# EAGLE design led-test (EAGLE 9.6.2)
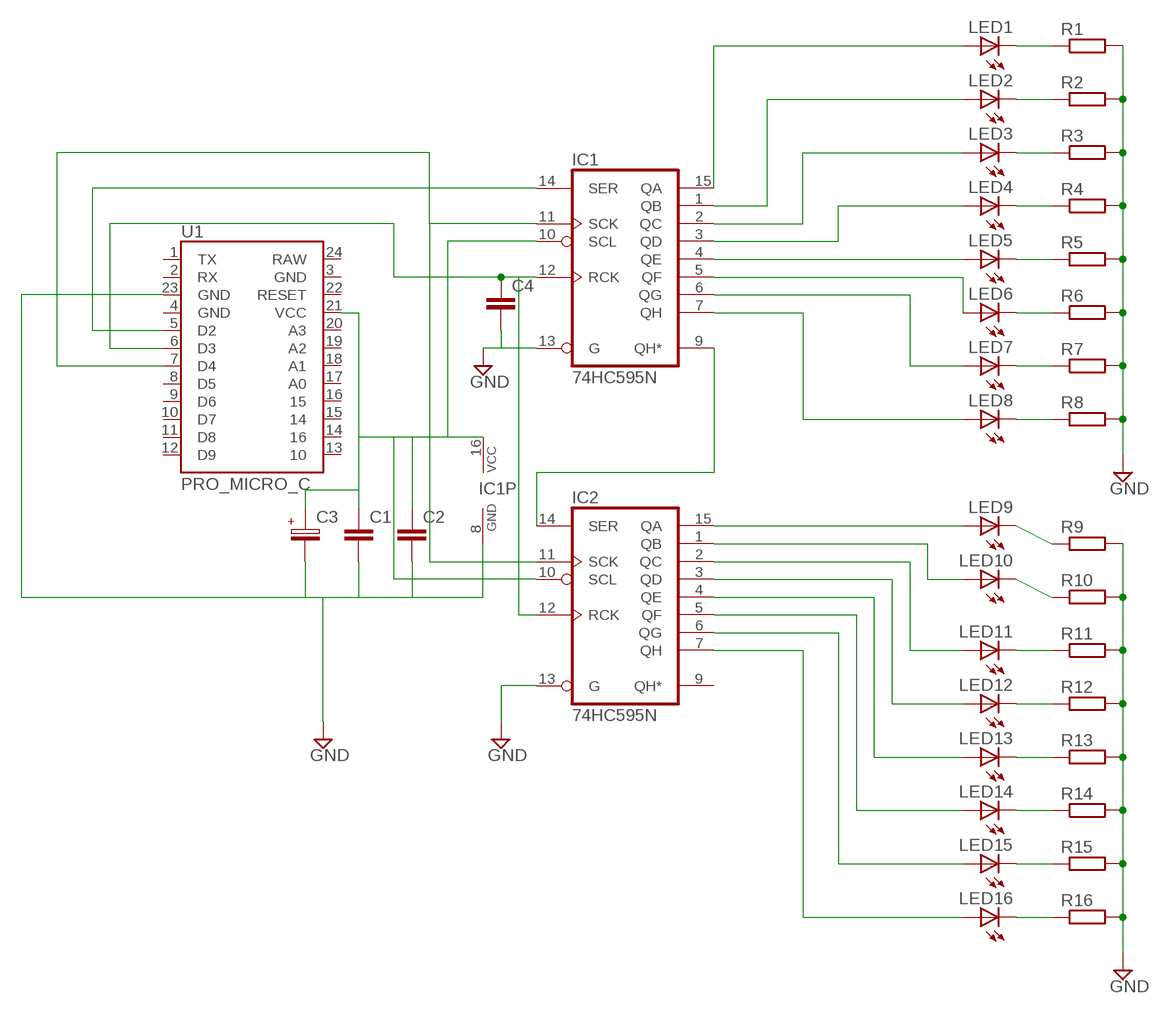
[diagram p0: schematic, sheet 1]

## Parts
C1  072X0252  [072X025]
C2  072X0252  [072X025]
C3  050-EU  [050_020]
C4  072X0252  [072X025]
IC1  74HC595N  [DIL16]
IC2  74HC595N  [DIL16]
LED1  LED  [SMARTLED-TTW]
LED2  LED  [SMARTLED-TTW]
LED3  LED  [SMARTLED-TTW]
LED4  LED  [SMARTLED-TTW]
LED5  LED  [SMARTLED-TTW]
LED6  LED  [SMARTLED-TTW]
LED7  LED  [SMARTLED-TTW]
LED8  LED  [SMARTLED-TTW]
LED9  LED  [SMARTLED-TTW]
LED10  LED  [SMARTLED-TTW]
LED11  LED  [SMARTLED-TTW]
LED12  LED  [SMARTLED-TTW]
LED13  LED  [SMARTLED-TTW]
LED14  LED  [SMARTLED-TTW]
LED15  LED  [SMARTLED-TTW]
LED16  LED  [SMARTLED-TTW]
R1  R-EU_0204/7  [0204/7]
R2  R-EU_0204/7  [0204/7]
R3  R-EU_0204/7  [0204/7]
R4  R-EU_0204/7  [0204/7]
R5  R-EU_0204/7  [0204/7]
R6  R-EU_0204/7  [0204/7]
R7  R-EU_0204/7  [0204/7]
R8  R-EU_0204/7  [0204/7]
R9  R-EU_0204/7  [0204/7]
R10  R-EU_0204/7  [0204/7]
R11  R-EU_0204/7  [0204/7]
R12  R-EU_0204/7  [0204/7]
R13  R-EU_0204/7  [0204/7]
R14  R-EU_0204/7  [0204/7]
R15  R-EU_0204/7  [0204/7]
R16  R-EU_0204/7  [0204/7]
U1  PRO_MICRO_C  [PRO_MICRO_C]

## Nets
GND: C1.2 C2.2 C3.- C4.2 IC1.8(GND) IC1.13(G) IC2.13(G) R1.2 R2.2 R3.2 R4.2 R5.2 R6.2 R7.2 R8.2 R9.2 R10.2 R11.2 R12.2 R13.2 R14.2 R15.2 R16.2 U1.23(GND)
N$1: C4.1 IC1.12(RCK) IC2.12(RCK) U1.6(D3)
N$2: IC1.14(SER) U1.5(D2)
N$4: IC1.11(SCK) IC2.11(SCK) U1.7(D4)
N$5: LED1.C@1(C) R1.1
N$7: IC1.15(QA) LED1.A@1(A)
N$8: IC1.1(QB) LED2.A@1(A)
N$9: IC1.2(QC) LED3.A@1(A)
N$10: IC1.3(QD) LED4.A@1(A)
N$11: IC1.4(QE) LED5.A@1(A)
N$12: IC1.5(QF) LED6.A@1(A)
N$13: IC1.6(QG) LED7.A@1(A)
N$14: IC1.7(QH) LED8.A@1(A)
N$15: LED2.C@1(C) R2.1
N$16: LED3.C@1(C) R3.1
N$17: LED4.C@1(C) R4.1
N$18: LED5.C@1(C) R5.1
N$19: LED6.C@1(C) R6.1
N$20: LED7.C@1(C) R7.1
N$21: LED8.C@1(C) R8.1
N$22: IC1.9(QH*) IC2.14(SER)
N$23: IC2.1(QB) LED10.A@1(A)
N$24: IC2.2(QC) LED11.A@1(A)
N$25: IC2.3(QD) LED12.A@1(A)
N$26: IC2.4(QE) LED13.A@1(A)
N$27: IC2.5(QF) LED14.A@1(A)
N$28: IC2.6(QG) LED15.A@1(A)
N$29: IC2.7(QH) LED16.A@1(A)
N$30: LED9.C@1(C) R9.1
N$31: LED10.C@1(C) R10.1
N$32: LED11.C@1(C) R11.1
N$33: LED12.C@1(C) R12.1
N$34: LED13.C@1(C) R13.1
N$35: LED14.C@1(C) R14.1
N$36: LED15.C@1(C) R15.1
N$37: LED16.C@1(C) R16.1
N$40: C1.1 C2.1 C3.+ IC1.10(SCL) IC1.16(VCC) IC2.10(SCL) U1.21(VCC)
N$41: IC2.15(QA) LED9.A@1(A)
Unconnected: IC2.9(QH*) U1.1(TX) U1.2(RX) U1.3(GND) U1.4(GND) U1.8(D5) U1.9(D6) U1.10(D7) U1.11(D8) U1.12(D9) U1.13 U1.14 U1.15 U1.16 U1.17(A0) U1.18(A1) U1.19(A2) U1.20(A3) U1.22(RESET) U1.24(RAW)

## Power pins joined to a net without a drawn wire
GND: IC2.8(GND)
N$40: IC2.16(VCC)

## Library data of the parts
C1 C2 C4 = gm-caps-film-box:072X025: 1000pF - 0.47uF WIMA MKP2 63, 100V: 1000pF - 0.015uF; MKS2 50V: 0.33 - 0.47uF; 63V: 1000pF - 0.22uF;
C3 = gm-caps-electro-pol:050-EU
IC1 IC2 = 74xx-eu:74*595: 8-bit SHIFT REGISTER, output latch
LED1-LED16 = led:LED: LED OSRAM: - CHIPLED LG R971, LG N971, LY N971, LG Q971, LY Q971, LO R971, LY R971 LH N974, LH R974 LS Q976, LO Q976, LY Q976 LO Q996 - Hyper CHIPLED LW Q18S LB Q993, LB Q99A, LB R99A - SideLED LS A670, LO A670, LY A670, LG A670, LP A670 LB A673, LV A673, LT A673, LW A673 LH A674 LY A675 LS A676, LA A676, LO A676, LY A676, LW A676 LS A679, LY A679, LG A679 - Hyper Micro SIDELED® LS Y876, LA Y876, LO Y876, LY Y876 LT Y87S - SmartLED LW L88C, LW L88S LB L89C, LB L89S, LG L890 LS L89K, LO L89K, LY L89K LS L896, LA L896, LO L896, LY L896 - TOPLED LS T670, LO T670, LY T670, LG T670, LP T670 LSG T670, LSP T670, LSY T670, LOP T670, LYG T670 LG T671, LOG T671, LSG T671 LB T673, LV T673, LT T673, LW T673 LH T674 LS T676, LA T676, LO T676, LY T676, LB T676, LH T676, LSB T676, LW T676 LB T67C, LV T67C, LT T67C, LS T67K, LO T67K, LY T67K, LW E67C LS E67B, LA E67B, LO E67B, LY E67B, LB E67C, LV E67C, LT E67C LW T67C LS T679, LY T679, LG T679 LS T770, LO T770, LY T770, LG T770, LP T770 LB T773, LV T773, LT T773, LW T773 LH T774 LS E675, LA E675, LY E675, LS T675 LS T776, LA T776, LO T776, LY T776, LB T776 LHGB T686 LT T68C, LB T68C - Hyper Mini TOPLED® LB M676 - Mini TOPLED Santana® LG M470 LS M47K, LO M47K, LY M47K Source: http://www.osram.convergy.de LUXEON: - LUMILED® LXK2-PW12-R00, LXK2-PW12-S00, LXK2-PW14-U00, LXK2-PW14-V00 LXK2-PM12-R00, LXK2-PM12-S00, LXK2-PM14-U00 LXK2-PE12-Q00, LXK2-PE12-R00, LXK2-PE12-S00, LXK2-PE14-T00, LXK2-PE14-U00 LXK2-PB12-K00, LXK2-PB12-L00, LXK2-PB12-M00, LXK2-PB14-N00, LXK2-PB14-P00, LXK2-PB14-Q00 LXK2-PR12-L00, LXK2-PR12-M00, LXK2-PR14-Q00, LXK2-PR14-R00 LXK2-PD12-Q00, LXK2-PD12-R00, LXK2-PD12-S00 LXK2-PH12-R00, LXK2-PH12-S00 LXK2-PL12-P00, LXK2-PL12-Q00, LXK2-PL12-R00 Source: www.luxeon.com KINGBRIGHT: KA-3528ASYC Source: www.kingbright.com
R1-R16 = resistor:R-EU_: RESISTOR, European symbol
U1 = SparkFun-Boards:PRO_MICRO_C

## Board
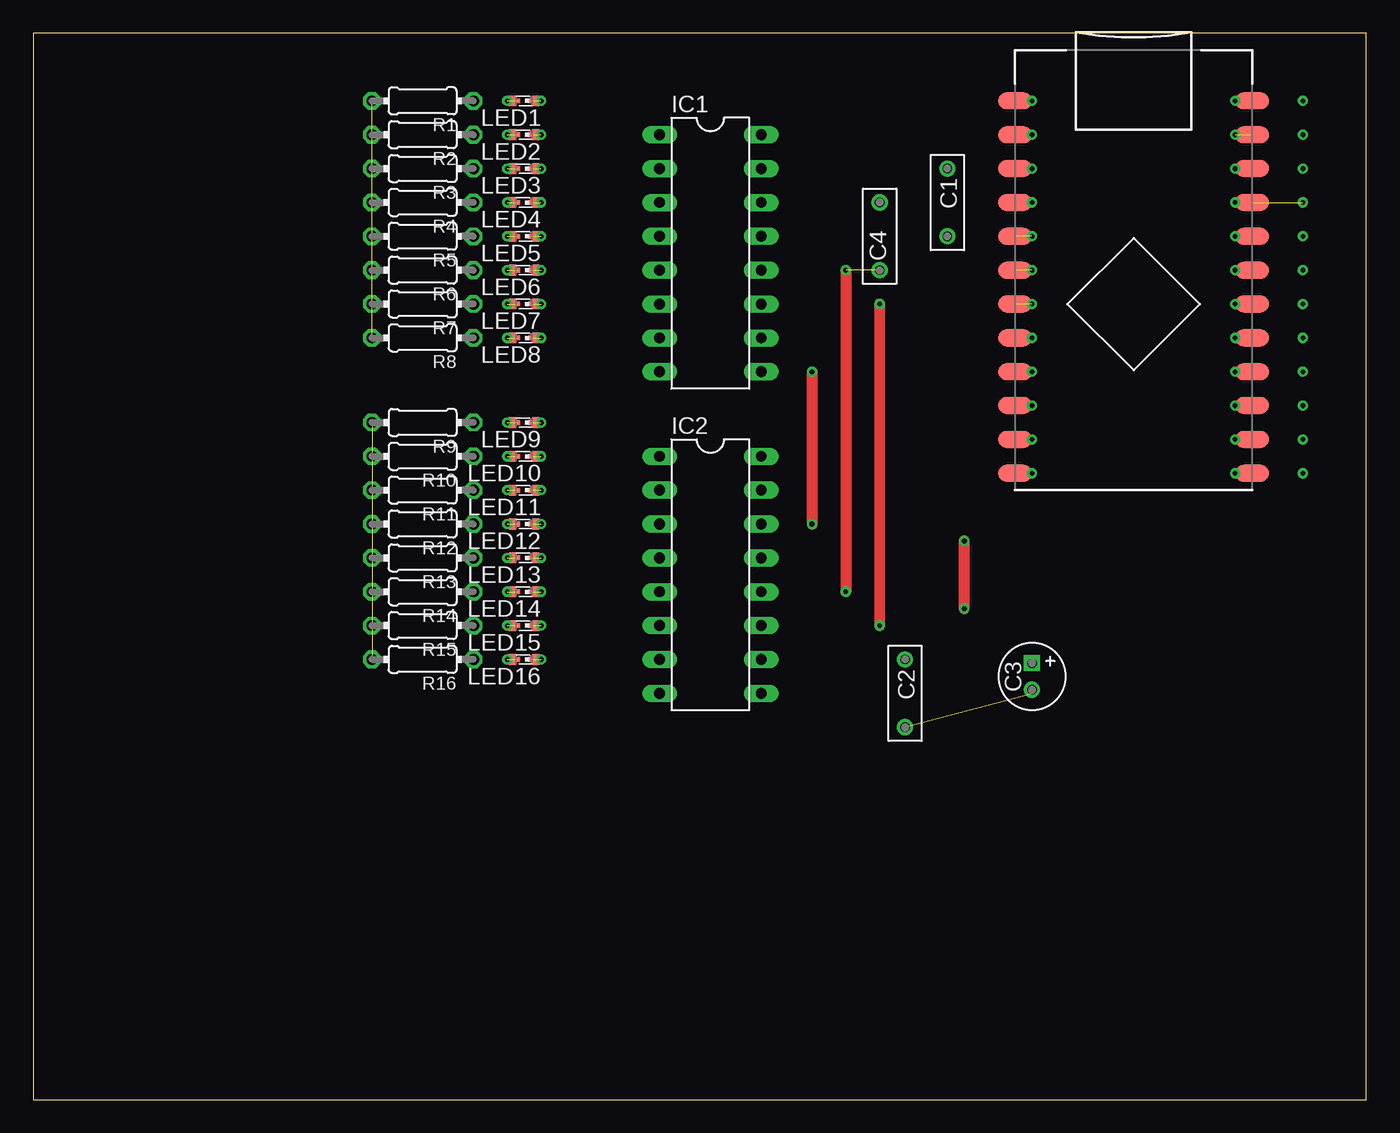
[diagram p1: board, top side]
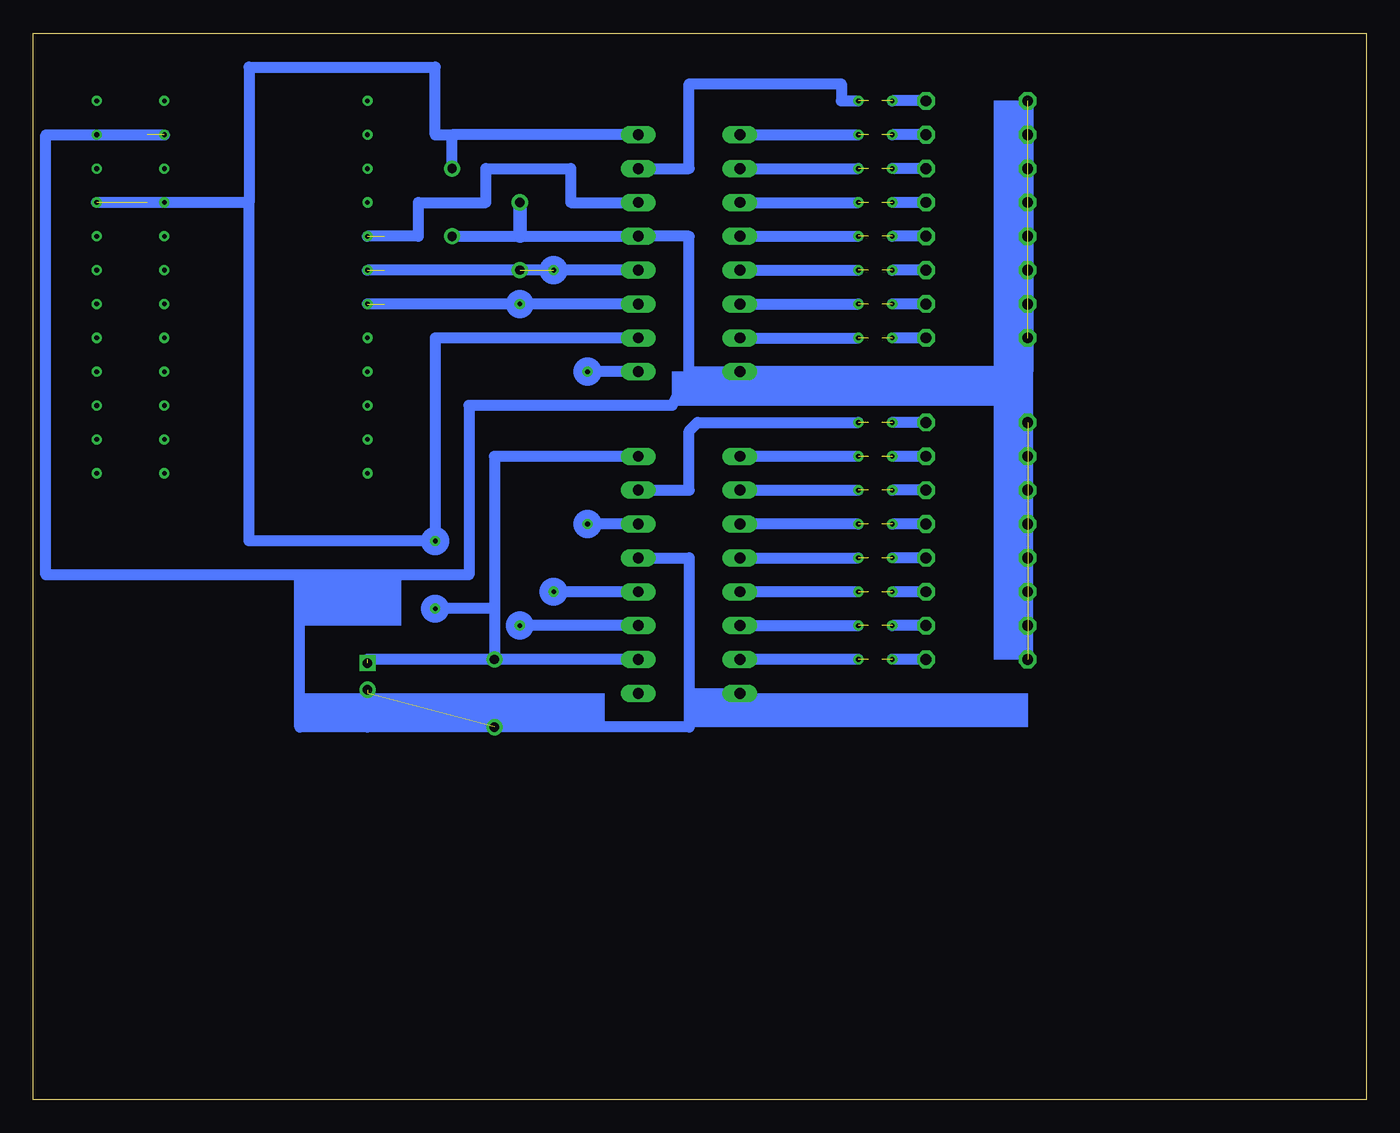
[diagram p2: board, bottom side, seen from below]

Size 100 x 80 mm. Coordinates in mm from the lower left corner, seen from the top.
Outline: 0,0 100,0 100,80 0,80 0,0
Copper layers (1*16): Top 0.035mm / dielectric 1.5mm / Bottom 0.035mm
Design rules "default": minimum track width 10mil, minimum drill 24mil, track to track 8mil, track to pad 8mil, pad to pad 8mil, via to via 8mil, smd to smd 8mil, copper to edge 40mil, drill to drill 8mil, minimum pad ring 10mil, minimum via ring 8mil, stop-mask expansion 4mil, vias tented up to drill 0mil, thermal gap 10mil

### Footprints (pad centres in the part's own frame; a part is rotated, then mirrored left to right if it is on the bottom)
072X025 = drill 0.7: 1 -2.54,0; 2 2.54,0
050_020 = drill 0.7 square: + -1,0 | drill 0.7: - 1,0
DIL16 = drill 0.813 long: 1 -8.89,-3.81; 2 -6.35,-3.81; 3 -3.81,-3.81; 4 -1.27,-3.81; 5 1.27,-3.81; 6 3.81,-3.81; 7 6.35,-3.81; 8 8.89,-3.81; 9 8.89,3.81; 10 6.35,3.81; 11 3.81,3.81; 12 1.27,3.81; 13 -1.27,3.81; 14 -3.81,3.81; 15 -6.35,3.81; 16 -8.89,3.81
SMARTLED-TTW = smd 0.8 x 0.5: A 0,-0.875; C 0,0.875 | smd 0.35 x 0.35: A@1 0,-0.5; C@1 0,0.5
0204/7 = drill 0.813 octagon: 1 -3.81,0; 2 3.81,0
PRO_MICRO_C = smd 2.54 x 1.27: 1 -8.89,12.7; 2 -8.89,10.16; 3 -8.89,7.62; 4 -8.89,5.08; 5 -8.89,2.54; 6 -8.89,0; 7 -8.89,-2.54; 8 -8.89,-5.08; 9 -8.89,-7.62; 10 -8.89,-10.16; 11 -8.89,-12.7; 12 -8.89,-15.24; 13 8.89,-15.24; 14 8.89,-12.7; 15 8.89,-10.16; 16 8.89,-7.62; 17 8.89,-5.08; 18 8.89,-2.54; 19 8.89,0; 20 8.89,2.54; 21 8.89,5.08; 22 8.89,7.62; 23 8.89,10.16; 24 8.89,12.7

### Placement (x,y rotation side)
C1  68.58,67.31 270 top
C2  65.41,30.48 270 top
C3  74.93,31.75 270 top
C4  63.5,64.77 90 top
IC1  50.8,63.5 270 top
IC2  50.8,39.37 270 top
LED1  36.83,74.93 90 top
LED2  36.83,72.39 90 top
LED3  36.83,69.85 90 top
LED4  36.83,67.31 90 top
LED5  36.83,64.77 90 top
LED6  36.83,62.23 90 top
LED7  36.83,59.69 90 top
LED8  36.83,57.15 90 top
LED9  36.83,50.8 90 top
LED10  36.83,48.26 90 top
LED11  36.83,45.72 90 top
LED12  36.83,43.18 90 top
LED13  36.83,40.64 90 top
LED14  36.83,38.1 90 top
LED15  36.83,35.56 90 top
LED16  36.83,33.02 90 top
R1  29.21,74.93 180 top
R2  29.21,72.39 180 top
R3  29.21,69.85 180 top
R4  29.21,67.31 180 top
R5  29.21,64.77 180 top
R6  29.21,62.23 180 top
R7  29.21,59.69 180 top
R8  29.21,57.15 180 top
R9  29.21,50.8 180 top
R10  29.21,48.26 180 top
R11  29.21,45.72 180 top
R12  29.21,43.18 180 top
R13  29.21,40.64 180 top
R14  29.21,38.1 180 top
R15  29.21,35.56 180 top
R16  29.21,33.02 180 top
U1  82.55,62.23 0 top

### Tracks (layer width: path | path; a pad name or v marks a point on that pad's centre or on a via)
GND  (via drill 0.35)  (17 unrouted)
  Bottom 0.813: 50.8,54.61 IC1.8 25.4,54.61 | 50.8,54.61 52.07,52.07 67.31,52.07 67.31,39.37 80.01,39.37 | 80.01,39.37 99.06,39.37 99.06,72.39 v95.25,72.39 v90.17,72.39 | 50.8,54.61 50.8,64.77 IC1.13 63.5,64.77 C1.2 | R1.2 25.4,54.61 | R16.2 25.4,54.61 | IC2.13 50.8,40.64 50.8,30.48 | 50.8,30.48 IC2.8 | 50.8,30.48 50.8,27.94 74.93,27.94 | 74.93,27.94 80.01,27.94 80.01,39.37 | 74.93,30.48 74.93,27.94
  Bottom 1.016: 63.5,64.77 C4.2
N$1  (via drill 0.35)  (2 unrouted)
  Top 0.813: v60.96,62.23 v60.96,38.1
  Bottom 0.813: IC1.12 v60.96,62.23 v74.93,62.23 | IC2.12 v60.96,38.1
N$2  (via drill 0.35)  (1 unrouted)
  Bottom 0.813: IC1.14 59.69,67.31 59.69,69.85 66.04,69.85 66.04,67.31 71.12,67.31 71.12,64.77 v74.93,64.77
N$3  (via drill 0.35)
  other vias: 74.93,74.93
N$4  (via drill 0.35)  (1 unrouted)
  Top 0.813: v63.5,35.56 v63.5,59.69
  Bottom 0.813: IC1.11 v63.5,59.69 v74.93,59.69 | IC2.11 v63.5,35.56
N$5  (via drill 0.35)  (1 unrouted)
  Bottom 0.813: R1.1 v35.56,74.93
N$6  (via drill 0.35)
  other vias: 74.93,72.39
N$7  (via drill 0.35)  (1 unrouted)
  Bottom 0.813: IC1.15 50.8,69.85 50.8,76.2 39.37,76.2 39.37,74.93 v38.1,74.93
N$8  (via drill 0.35)  (1 unrouted)
  Bottom 0.813: IC1.1 v38.1,72.39
N$9  (via drill 0.35)  (1 unrouted)
  Bottom 0.813: IC1.2 v38.1,69.85
N$10  (via drill 0.35)  (1 unrouted)
  Bottom 0.813: IC1.3 v38.1,67.31
N$11  (via drill 0.35)  (1 unrouted)
  Bottom 0.813: IC1.4 v38.1,64.77
N$12  (via drill 0.35)  (1 unrouted)
  Bottom 0.813: IC1.5 v38.1,62.23
N$13  (via drill 0.35)  (1 unrouted)
  Bottom 0.813: IC1.6 v38.1,59.69
N$14  (via drill 0.35)  (1 unrouted)
  Bottom 0.813: IC1.7 v38.1,57.15
N$15  (via drill 0.35)  (1 unrouted)
  Bottom 0.813: R2.1 v35.56,72.39
N$16  (via drill 0.35)  (1 unrouted)
  Bottom 0.813: R3.1 v35.56,69.85
N$17  (via drill 0.35)  (1 unrouted)
  Bottom 0.813: R4.1 v35.56,67.31
N$18  (via drill 0.35)  (1 unrouted)
  Bottom 0.813: R5.1 v35.56,64.77
N$19  (via drill 0.35)  (1 unrouted)
  Bottom 0.813: R6.1 v35.56,62.23
N$20  (via drill 0.35)  (1 unrouted)
  Bottom 0.813: R7.1 v35.56,59.69
N$21  (via drill 0.35)  (1 unrouted)
  Bottom 0.813: R8.1 v35.56,57.15
N$22  (via drill 0.35)
  Top 0.813: v58.42,54.61 v58.42,43.18
  Bottom 0.813: IC1.9 v58.42,54.61 | IC2.14 v58.42,43.18
N$23  (via drill 0.35)  (1 unrouted)
  Bottom 0.813: v38.1,48.26 IC2.1
N$24  (via drill 0.35)  (1 unrouted)
  Bottom 0.813: IC2.2 v38.1,45.72
N$25  (via drill 0.35)  (1 unrouted)
  Bottom 0.813: v38.1,43.18 IC2.3
N$26  (via drill 0.35)  (1 unrouted)
  Bottom 0.813: IC2.4 v38.1,40.64
N$27  (via drill 0.35)  (1 unrouted)
  Bottom 0.813: v38.1,38.1 IC2.5
N$28  (via drill 0.35)  (1 unrouted)
  Bottom 0.813: IC2.6 v38.1,35.56
N$29  (via drill 0.35)  (1 unrouted)
  Bottom 0.813: v38.1,33.02 IC2.7
N$30  (via drill 0.35)  (1 unrouted)
  Bottom 0.813: R9.1 v35.56,50.8
N$31  (via drill 0.35)  (1 unrouted)
  Bottom 0.813: R10.1 v35.56,48.26
N$32  (via drill 0.35)  (1 unrouted)
  Bottom 0.813: R11.1 v35.56,45.72
N$33  (via drill 0.35)  (1 unrouted)
  Bottom 0.813: R12.1 v35.56,43.18
N$34  (via drill 0.35)  (1 unrouted)
  Bottom 0.813: R13.1 v35.56,40.64
N$35  (via drill 0.35)  (1 unrouted)
  Bottom 0.813: R14.1 v35.56,38.1
N$36  (via drill 0.35)  (1 unrouted)
  Bottom 0.813: R15.1 v35.56,35.56
N$37  (via drill 0.35)  (1 unrouted)
  Bottom 0.813: R16.1 v35.56,33.02
N$38  (via drill 0.35)
  other vias: 74.93,69.85
N$39  (via drill 0.35)
  other vias: 74.93,67.31
N$40  (via drill 0.35)  (2 unrouted)
  Top 0.813: v69.85,36.83 v69.85,41.91
  Bottom 0.813: 65.41,36.83 v69.85,36.83 | 83.82,67.31 83.82,41.91 v69.85,41.91 69.85,57.15 IC1.10 | 83.82,67.31 v95.25,67.31 | 83.82,67.31 83.82,77.47 69.85,77.47 69.85,72.39 68.58,72.39 | IC1.16 68.58,72.39 | IC2.10 C2.1 | IC2.16 65.41,48.26 65.41,36.83 | 65.41,36.83 C2.1 | C1.1 68.58,72.39 | C2.1 74.93,33.02
N$41  (via drill 0.35)  (1 unrouted)
  Bottom 0.813: IC2.15 50.8,45.72 50.8,50.16 50.16,50.8 v38.1,50.8
N$42  (via drill 0.35)
  other vias: 74.93,57.15
N$43  (via drill 0.35)
  other vias: 74.93,54.61
N$44  (via drill 0.35)
  other vias: 74.93,52.07
N$45  (via drill 0.35)
  other vias: 74.93,49.53
N$46  (via drill 0.35)
  other vias: 74.93,46.99
N$47  (via drill 0.35)
  other vias: 90.17,46.99
N$48  (via drill 0.35)
  other vias: 90.17,49.53
N$49  (via drill 0.35)
  other vias: 90.17,52.07
N$50  (via drill 0.35)
  other vias: 90.17,54.61
N$51  (via drill 0.35)
  other vias: 90.17,57.15
N$52  (via drill 0.35)
  other vias: 90.17,59.69
N$53  (via drill 0.35)
  other vias: 90.17,62.23
N$54  (via drill 0.35)
  other vias: 90.17,64.77
N$55  (via drill 0.35)
  other vias: 90.17,69.85
N$56  (via drill 0.35)
  other vias: 90.17,74.93
N$57  (via drill 0.35)
  other vias: 95.25,74.93
N$58  (via drill 0.35)
  other vias: 95.25,69.85
N$59  (via drill 0.35)
  other vias: 90.17,67.31
N$60  (via drill 0.35)
  other vias: 95.25,64.77
N$61  (via drill 0.35)
  other vias: 95.25,62.23
N$62  (via drill 0.35)
  other vias: 95.25,59.69
N$63  (via drill 0.35)
  other vias: 95.25,57.15
N$64  (via drill 0.35)
  other vias: 95.25,54.61
N$65  (via drill 0.35)
  other vias: 95.25,46.99
N$66  (via drill 0.35)
  other vias: 95.25,52.07
N$67  (via drill 0.35)
  other vias: 95.25,49.53
(copper drawn outside any net)
  shapes: Bottom area x6, Bottom circle x8